# Altium schematic sheet fuse.schdoc: Fuse
size A4; Organization: Altium Limited; Address1: L3, 12a Rodborough Rd; Address2: Frenchs Forest; Address3: NSW; Address4: Australia 2086; DocumentNumber: 1; SheetNumber: 1; SheetTotal: 1
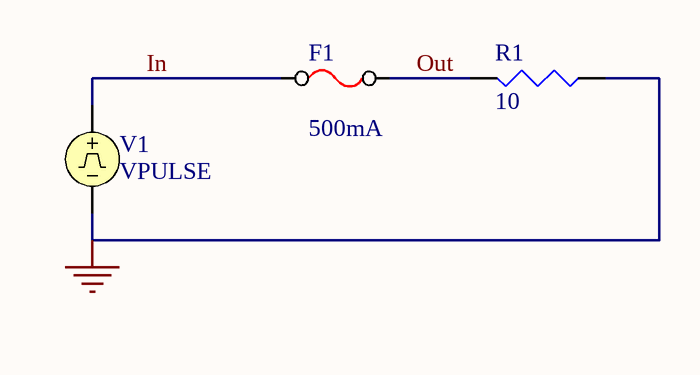
[diagram p0: fuse.schdoc]

## Parts
F1  500mA
R1  10
V1  VPULSE

## Nets
GND: R1.2(BOT) V1.2
In: F1.1 V1.1
Out: F1.2 R1.1(TOP)

## Notes on the sheet
- Title
- Size:
- Date:
- A4
- Number:
- Time:
- Revision:
- Sheet
- of
- File:

## Library data of the parts
F1 = FUSE: CURRENT: 500mA
R1 = RES: Resistor; Value: 10
V1 = VPULSE: Pulse Voltage Source